# EasyEDA Pro project ProPrj_Y车Y形板_2025-09-30.epro, board 转线板
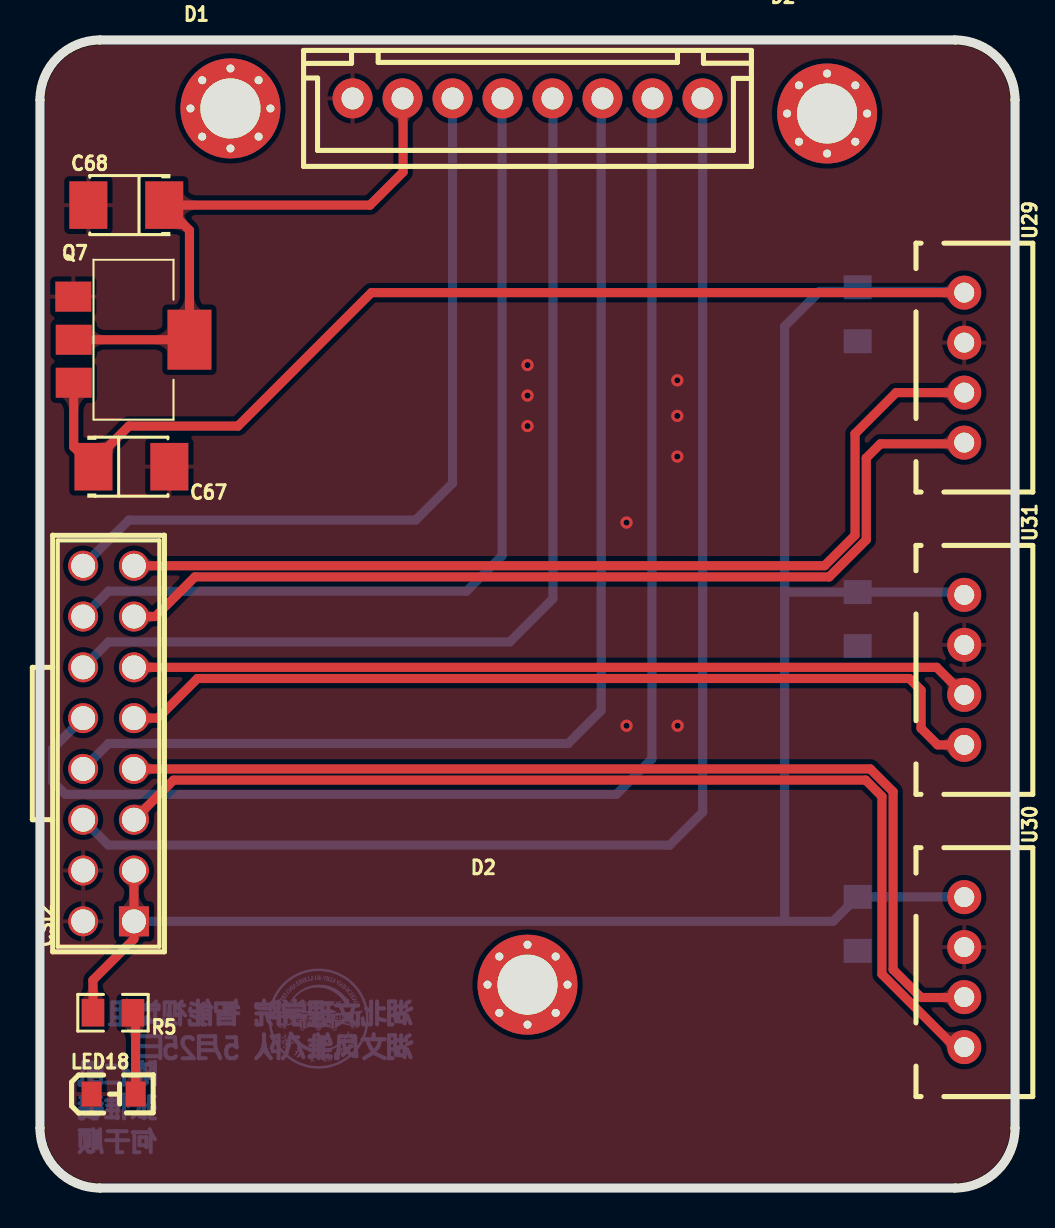
[diagram p16: board, top side]
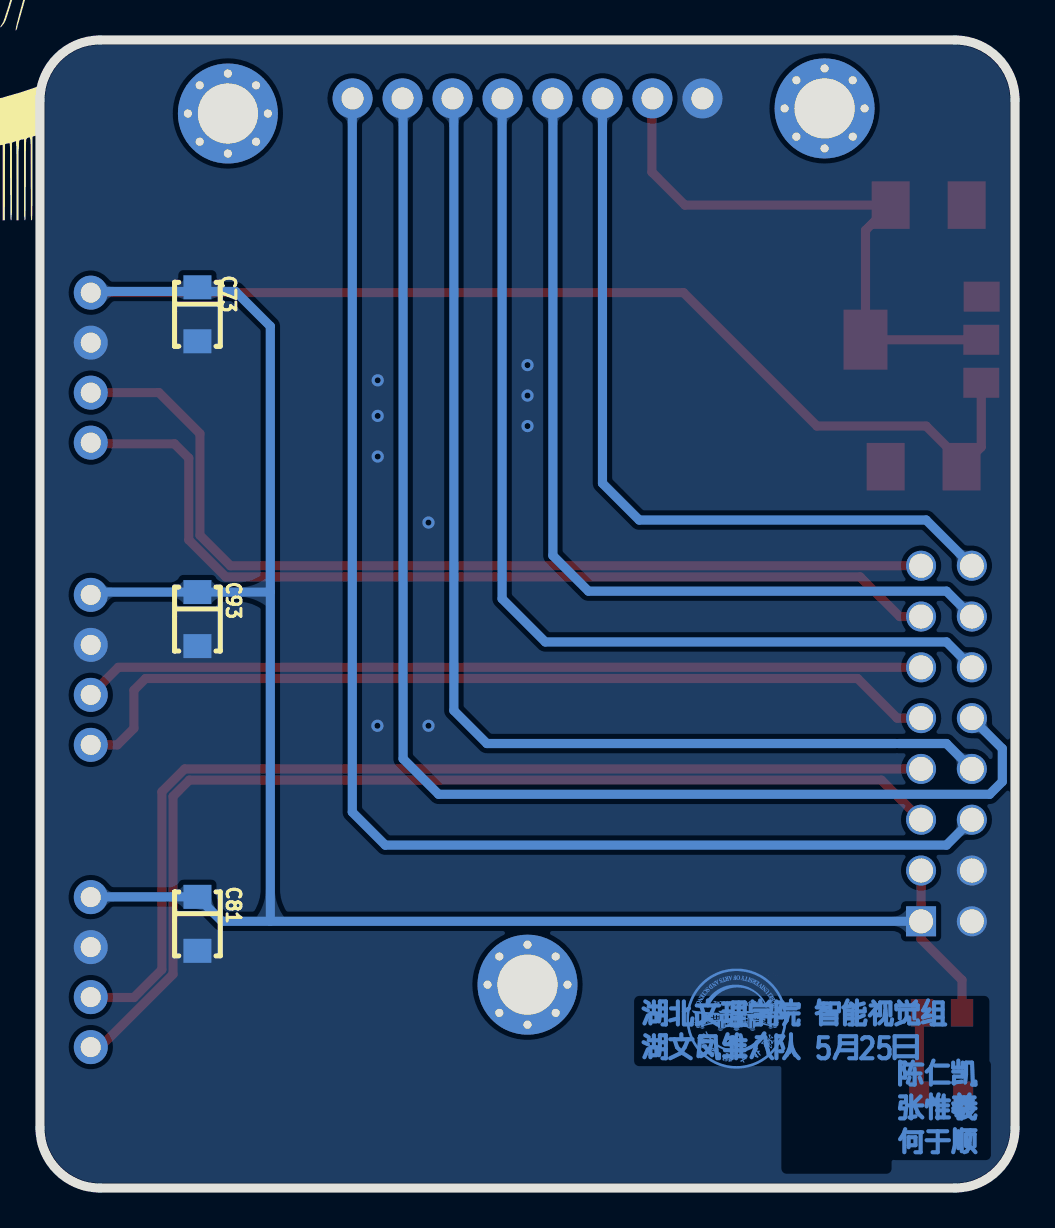
[diagram p17: board, bottom side, seen from below]

Outline 48.77 x 57.4 mm; copper layers: Top Layer, Bottom Layer. Coordinates in mm from the lower left corner of the outline.
Outline path: 0,54.4 0,3 arc(0.88,0.88) 3,0 45.77,0 arc(47.89,0.88) 48.77,3 48.77,54.4 arc(47.89,56.53) 45.77,57.4 3,57.4 arc(0.88,56.53) 0,54.4
Stack: Top Layer 0.035mm / Dielectric1 1.51mm FR4 er 4.5 / Bottom Layer 0.035mm

## Design rules (mm)
template: 自定义配置
spacing copperThickness1oz (default): track to track 0.102, other pairs 0.152 to 0.3
spacing copperThickness2oz: track to track 0.203, other pairs 0.152 to 0.3
track width copperThickness1oz (default): min 0.127, default 0.254, max 2.54
track width copperThickness2oz: min 0.203, default 0.254, max 2.54
differential pair differentialPair (default): width min 0.127, default 0.254, max 2.54; gap min 0.152, default 0.152
via viaSize (default): diameter min 0.5, default 0.61, max 10; hole min 0.3, default 0.305, max 6.3
pour e240 uses copperRegion1

## Placement (name value [footprint] x y rotation side)
C67  10uF  [CAP-SMD_L3.5-W2.8-R-RD]  4.57 36.07 180 top
C68  10uF  [CAP-SMD_L3.5-W2.8-R-RD]  4.32 49.15 0 top
C73  22uF  [CAP-SMD_L3.2-W1.6]  40.89 43.69 270 bottom
C81  22uF  [CAP-SMD_L3.2-W1.6]  40.89 13.21 270 bottom
C93  22uF  [CAP-SMD_L3.2-W1.6]  40.89 28.45 270 bottom
CSI2  2.54-2*8P针  [HDR-TH_16P-P2.54-V-M-R2-C8-S2.54]  3.43 22.23 90 top
D1  -  [M3]  9.52 53.98 0 top
D2  -  [M3]  24.38 10.16 0 top
D2#2  -  [M3]  39.37 53.72 0 top
LED18  NCD0805R1  [LED0805-RD]  3.68 4.7 0 top
Q7  AMS1117-3.3V  [AMS1117]  4.57 42.42 270 top
R5  4.7K  [R0805]  3.65 8.76 180 top
U29  B4B-XH-A(LF)(SN)  [CONN-TH_B4B-XH-A-LF-SN]  46.23 41.02 270 top
U30  B4B-XH-A(LF)(SN)  [CONN-TH_B4B-XH-A-LF-SN]  46.23 10.8 270 top
U31  B4B-XH-A(LF)(SN)  [CONN-TH_B4B-XH-A-LF-SN]  46.23 25.91 270 top
屏幕1  WAFER-XH2.54-8PZZ  [CONN-TH_8P-P2.50-XH2.54-8P]  24.38 54.48 0 top

## Footprints (pads in the part's own frame, mm; a bottom-side part is the same pattern mirrored in y, then rotated)
AMS1117
  rect 1.5x1.8 smd: 1(-2.153,-2.905) 2(0.003,-2.884) 3(2.153,-2.884)
  rect 3x2.2 smd: 2(0,2.905)
CAP-SMD_L3.2-W1.6
  rect 1.2x1.4 smd: 1(-1.35,0) 2(1.35,0)
CAP-SMD_L3.5-W2.8-R-RD
  rect 1.9x2.376 smd: 1(1.899,0) 2(-1.899,0)
CONN-TH_8P-P2.50-XH2.54-8P
  round 2 hole 1.1: 1(8.75,0) 2(6.25,0) 3(3.75,0) 4(1.25,0) 5(-1.25,0) 6(-3.75,0) 7(-6.25,0) 8(-8.75,0)
CONN-TH_B4B-XH-A-LF-SN
  round 1.7 hole 1: 1(3.75,0) 2(1.25,0) 3(-1.25,0) 4(-3.75,0)
HDR-TH_16P-P2.54-V-M-R2-C8-S2.54
  rect 1.5x1.5 hole 1.2x0.9: 1(-8.89,-1.27)
  round 1.5 hole 1.2x0.9: 2(-8.89,1.27) 3(-6.35,-1.27) 4(-6.35,1.27) 5(-3.81,-1.27) 6(-3.81,1.27) 7(-1.27,-1.27) 8(-1.27,1.27) 9(1.27,-1.27) 10(1.27,1.27) 11(3.81,-1.27) 12(3.81,1.27) 13(6.35,-1.27) 14(6.35,1.27) 15(8.89,-1.27) 16(8.89,1.27)
LED0805-RD
  rect 1x1.25 smd: 1(-1.1,0) 2(1.1,0)
M3
  round 0.6 hole 0.405x0.4: 1(-2,0.007) 1(-1.41,1.417) 1(-1.41,-1.403) 1(0,2.007) 1(0,-1.993) 1(1.41,1.417) 1(1.41,-1.403) 1(2,0.007)
  round 5 hole 3.005x3: 1(0,0.007)
R0805
  rect 1.133x1.377 smd: 1(-1,0) 2(1,0)

## Nets
As in the schematic.

Pads without a net: D1 1; D2 1; D2#2 1

## Via types
v1: diameter 0.61, hole 0.305, Top Layer to Bottom Layer, 9 vias

## Routing (per net, layer and track width the routed paths; a pad name or vN(x,y) marks a point on that pad's centre or on a via; arc(x,y) is an arc through that point)
3V3: length 29.4
  Top Layer w0.457: Q7.2 7.47,42.42 Q7.2 7.48,47.89 C68.1 16.51,49.15 18.16,50.8 18.16,54.46 屏幕1.7
GND:
  vias: v1(24.38,41.15) v1(24.38,39.62) v1(24.38,38.1) v1(29.34,33.27) v1(29.34,23.11) v1(31.88,40.39) v1(31.88,38.61) v1(31.88,36.58) v1(31.89,23.11)
VCC5V: length 150.4
  Top Layer w0.457: 4.7,15.88 CSI2.1 4.7,12.45 2.65,10.4 R5.2 ; Q7.3 1.69,37.05 C67.1 2.67,36.33 4.45,38.1 9.91,38.1 16.58,44.77 U29.4
  Bottom Layer w0.457: 37.25,29.8 C93.1 46.09,29.8 U31.4 ; 37.25,29.8 37.25,13.34 ; 37.25,29.8 37.25,43.09 38.99,44.83 46.17,44.83 U29.4 ; 37.25,13.34 39.67,13.34 C81.1 46.22,14.56 U30.4 ; 37.25,13.34 CSI2.1
B0: length 39.4
  Bottom Layer w0.457: 屏幕1.6 20.63,35.24 18.8,33.4 4.45,33.4 CSI2.16
B1: length 45.1
  Bottom Layer w0.457: 屏幕1.5 23.11,54.46 23.11,31.62 21.34,29.84 3.43,29.84 CSI2.14
B2: length 49.9
  Bottom Layer w0.457: 屏幕1.4 25.65,54.46 25.65,29.46 23.49,27.31 3.43,27.31 2.16,26.03
B3: length 67.8
  Bottom Layer w0.457: CSI2.10 0.64,21.97 0.64,20.32 1.27,19.69 28.83,19.69 30.61,21.46 30.61,54.46 屏幕1.2
B12_TX: length 47.5
  Top Layer w0.457: U29.1 46.17,37.21 42.04,37.21 41.33,36.5 41.33,32.41 39.47,30.56 7.75,30.56 5.77,28.58 CSI2.13
B13_RX: length 48.1
  Top Layer w0.457: U29.2 42.82,39.77 40.77,37.72 40.77,32.64 39.24,31.12 CSI2.15
B18_TX: length 44.8
  Top Layer w0.457: U31.1 44.9,22.16 44.07,22.99 44.07,24.89 43.48,25.48 7.87,25.48 5.89,23.5 CSI2.9
B19_RX: length 42.1
  Top Layer w0.457: 4.7,26.03 44.85,26.03 U31.2
C16_TX: length 53.1
  Top Layer w0.457: CSI2.5 6.68,20.4 41.3,20.4 42.11,19.58 42.11,10.69 45.76,7.05 U30.1
C17_RX: length 51.5
  Top Layer w0.457: 4.7,20.95 41.53,20.95 42.67,19.81 42.67,10.92 44.07,9.53 46.21,9.53 U30.2
C18: length 67.9
  Bottom Layer w0.457: 屏幕1.1 33.15,54.47 33.15,18.8 31.5,17.14 3.43,17.14 CSI2.6
C19: length 57.6
  Bottom Layer w0.457: 5.84,22.23 3.43,22.23 2.16,20.95 ; 5.97,22.23 26.42,22.23 28.07,23.88 28.07,54.42 屏幕1.3
$1N1637: length 4.1
  Top Layer w0.457: R5.1 4.78,8.63 LED18.2

## Copper pours and planes (outline as drawn; the poured copper is in the pictures)
GND on Top Layer: -10.54,65.15 51.18,65.15 51.18,-3.68 -10.54,-3.68
GND on Bottom Layer: -5.97,60.96 55.75,60.96 55.75,-7.87 -5.97,-7.87

Small or netless copper shapes (teardrops, artwork), in the pictures only: 96 on Bottom Layer, 27 on Top Layer

## Text on the board
Bottom Layer: 陈仁凯 / 张惟羲 / 何于顺 | 湖北文理学院 智能视觉组 / 湖文凤雏八队 5月25日
